# Altium schematic sheet Sheet1.SchDoc
size A4
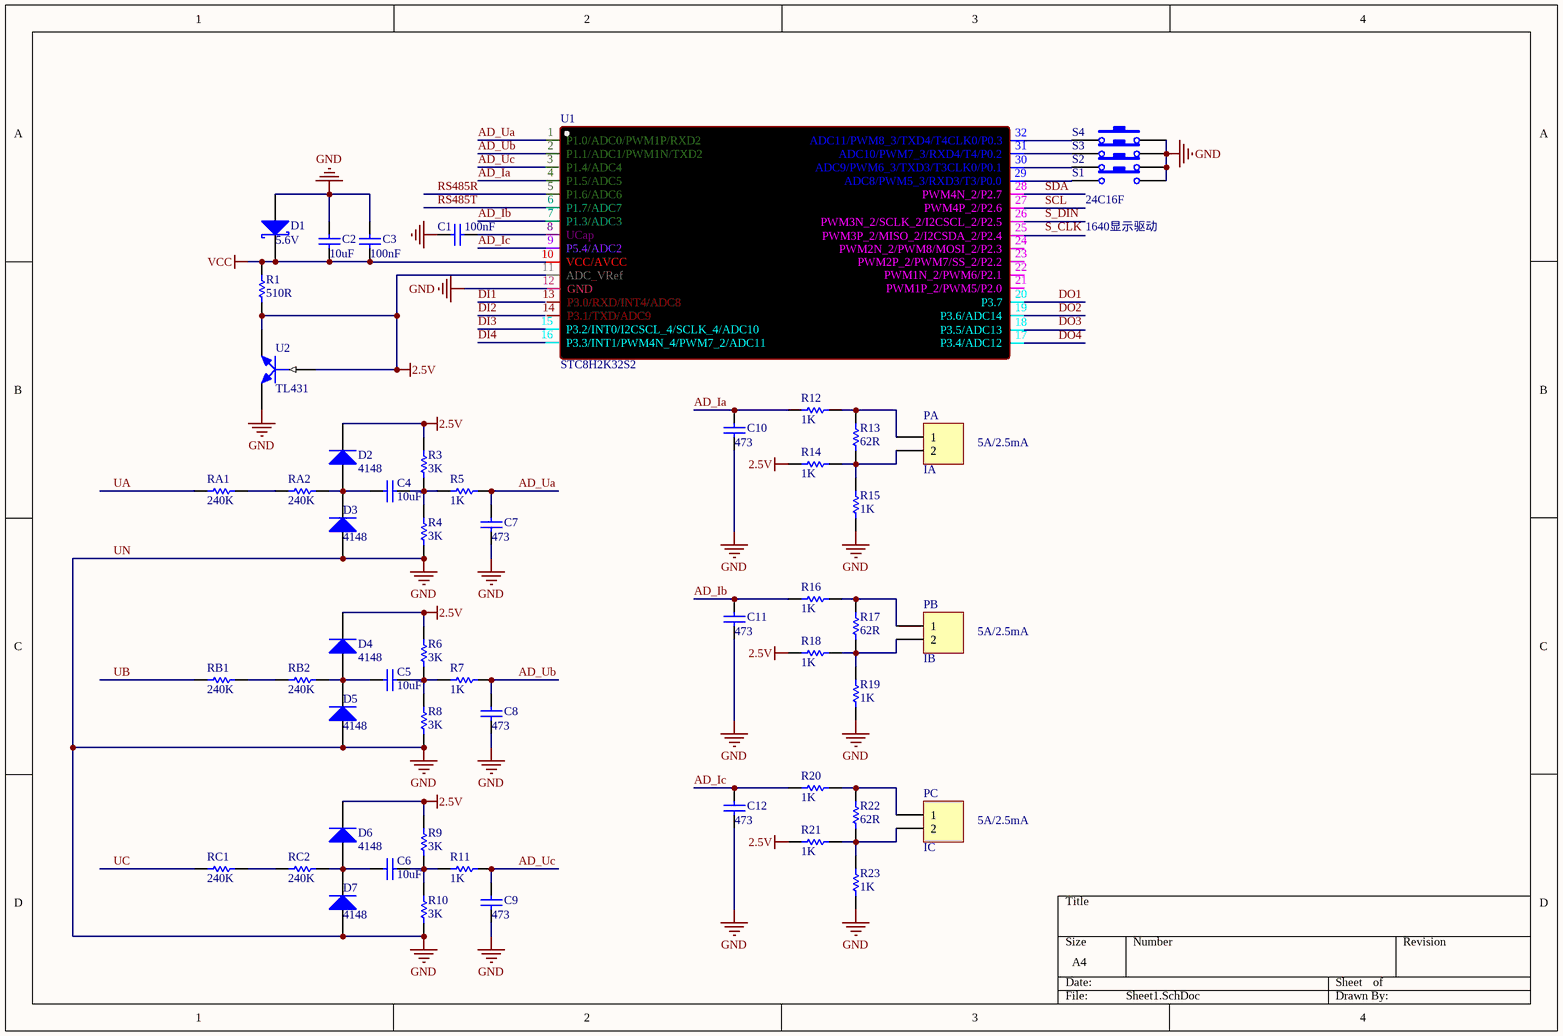
[diagram p0: Sheet1.SchDoc]

## Parts
C1  value 100nF  [RAD-0.3]  (hidden comment: Cap)
C2  value 10uF  [RAD-0.3]  (hidden comment: Cap)
C3  value 100nF  [RAD-0.3]  (hidden comment: Cap)
C4  value 10uF  [RAD-0.3]  (hidden comment: Cap)
C5  value 10uF  [RAD-0.3]  (hidden comment: Cap)
C6  value 10uF  [RAD-0.3]  (hidden comment: Cap)
C7  value 473  [RAD-0.3]  (hidden comment: Cap)
C8  value 473  [RAD-0.3]  (hidden comment: Cap)
C9  value 473  [RAD-0.3]  (hidden comment: Cap)
C10  value 473  [RAD-0.3]  (hidden comment: Cap)
C11  value 473  [RAD-0.3]  (hidden comment: Cap)
C12  value 473  [RAD-0.3]  (hidden comment: Cap)
D1  5.6V  [TO-220AC]
D2  4148  [SOT-23_N]
D3  4148  [SOT-23_N]
D4  4148  [SOT-23_N]
D5  4148  [SOT-23_N]
D6  4148  [SOT-23_N]
D7  4148  [SOT-23_N]
PA  IA  [HDR1X2]
PB  IB  [HDR1X2]
PC  IC  [HDR1X2]
R1  value 510R  [AXIAL-0.3]  (hidden comment: Res1)
R3  value 3K  [AXIAL-0.3]  (hidden comment: Res1)
R4  value 3K  [AXIAL-0.3]  (hidden comment: Res1)
R5  value 1K  [AXIAL-0.3]  (hidden comment: Res1)
R6  value 3K  [AXIAL-0.3]  (hidden comment: Res1)
R7  value 1K  [AXIAL-0.3]  (hidden comment: Res1)
R8  value 3K  [AXIAL-0.3]  (hidden comment: Res1)
R9  value 3K  [AXIAL-0.3]  (hidden comment: Res1)
R10  value 3K  [AXIAL-0.3]  (hidden comment: Res1)
R11  value 1K  [AXIAL-0.3]  (hidden comment: Res1)
R12  value 1K  [AXIAL-0.3]  (hidden comment: Res1)
R13  value 62R  [AXIAL-0.3]  (hidden comment: Res1)
R14  value 1K  [AXIAL-0.3]  (hidden comment: Res1)
R15  value 1K  [AXIAL-0.3]  (hidden comment: Res1)
R16  value 1K  [AXIAL-0.3]  (hidden comment: Res1)
R17  value 62R  [AXIAL-0.3]  (hidden comment: Res1)
R18  value 1K  [AXIAL-0.3]  (hidden comment: Res1)
R19  value 1K  [AXIAL-0.3]  (hidden comment: Res1)
R20  value 1K  [AXIAL-0.3]  (hidden comment: Res1)
R21  value 1K  [AXIAL-0.3]  (hidden comment: Res1)
R22  value 62R  [AXIAL-0.3]  (hidden comment: Res1)
R23  value 1K  [AXIAL-0.3]  (hidden comment: Res1)
RA1  value 240K  [AXIAL-0.3]  (hidden comment: Res1)
RA2  value 240K  [AXIAL-0.3]  (hidden comment: Res1)
RB1  value 240K  [AXIAL-0.3]  (hidden comment: Res1)
RB2  value 240K  [AXIAL-0.3]  (hidden comment: Res1)
RC1  value 240K  [AXIAL-0.3]  (hidden comment: Res1)
RC2  value 240K  [AXIAL-0.3]  (hidden comment: Res1)
S1  SW-PB  [SPST-2]  (value not drawn)
S2  SW-PB  [SPST-2]  (value not drawn)
S3  SW-PB  [SPST-2]  (value not drawn)
S4  SW-PB  [SPST-2]  (value not drawn)
U1  STC8H2K32S2  [LQFP32]
U2  TL431  [TO-262-AA]

## Nets
2.5V: D2.3(K) D4.3(K) D6.3(K) R1.2 R3.2 R6.2 R9.2 R14.2 R18.2 R21.2 U1.11(ADC_VRef) U2.1(B) U2.2(C)
UN: C1.1 C2.2 C3.2 C7.2 C8.2 C9.2 C10.2 C11.2 C12.2 D1.3(A) D3.1(A) D5.1(A) D7.1(A) R4.1 R8.1 R10.1 R15.2 R19.2 R23.2 S1.2 S2.2 S3.2 S4.2 U1.12(GND) U2.3(E)  [also labelled GND]
VCC: C2.1 C3.1 D1.1(K) R1.1 U1.10(VCC/AVCC)
AD_Ia: C10.1 R12.2 U1.4(P1.5/ADC5)
AD_Ib: C11.1 R16.2 U1.7(P1.3/ADC3)
AD_Ic: C12.1 R20.2 U1.9(P5.4/ADC2)
AD_Ua: C7.1 R5.1 U1.1(P1.0/ADC0/PWM1P/RXD2)
AD_Ub: C8.1 R7.1 U1.2(P1.1/ADC1/PWM1N/TXD2)
AD_Uc: C9.1 R11.1 U1.3(P1.4/ADC4)
DI3: U1.15(P3.2/INT0/I2CSCL_4/SCLK_4/ADC10)
DI4: U1.16(P3.3/INT1/PWM4N_4/PWM7_2/ADC11)
DO1: U1.20(P3.7)
DO2: U1.19(P3.6/ADC14)
DO4: U1.17(P3.4/ADC12)
RS485R: U1.5(P1.6/ADC6)
RS485T: U1.6(P1.7/ADC7)
S_DIN: U1.26(PWM3N_2/SCLK_2/I2CSCL_2/P2.5)
SCL: U1.27(PWM4P_2/P2.6)
SDA: U1.28(PWM4N_2/P2.7)
UA: RA1.1
UB: RB1.1
UC: RC1.1
NetC1_2: C1.2 U1.8(UCap)
NetC4_1: C4.1 R3.1 R4.2 R5.2
NetC4_2: C4.2 D2.1(A) D3.3(K) RA2.2
NetC5_1: C5.1 R6.1 R7.2 R8.2
NetC5_2: C5.2 D4.1(A) D5.3(K) RB2.2
NetC6_1: C6.1 R9.1 R10.2 R11.2
NetC6_2: C6.2 D6.1(A) D7.3(K) RC2.2
NetPA_1: PA.1 R12.1 R13.2
NetPA_2: PA.2 R13.1 R14.1 R15.1
NetPB_1: PB.1 R16.1 R17.2
NetPB_2: PB.2 R17.1 R18.1 R19.1
NetPC_1: PC.1 R20.1 R22.2
NetPC_2: PC.2 R21.1 R22.1 R23.1
NetRA1_2: RA1.2 RA2.1
NetRB1_2: RB1.2 RB2.1
NetRC1_2: RC1.2 RC2.1
NetS1_1: S1.1 U1.29(ADC8/PWM5_3/RXD3/T3/P0.0)
NetS2_1: S2.1 U1.30(ADC9/PWM6_3/TXD3/T3CLK0/P0.1)
NetS3_1: S3.1 U1.31(ADC10/PWM7_3/RXD4/T4/P0.2)
NetS4_1: S4.1 U1.32(ADC11/PWM8_3/TXD4/T4CLK0/P0.3)

Not connected (* = marked no-connect by the designer): U1 13(P3.0/RXD/INT4/ADC8) 14(P3.1/TXD/ADC9) 18(P3.5/ADC13) 21(PWM1P_2/PWM5/P2.0) 22(PWM1N_2/PWM6/P2.1) 23(PWM2P_2/PWM7/SS_2/P2.2) 24(PWM2N_2/PWM8/MOSI_2/P2.3) 25(PWM3P_2/MISO_2/I2CSDA_2/P2.4)

## Notes on the sheet
- (near S1) 24C16F
- 1640显示驱动
- 5A/2.5mA
- Labels drawn without touching a wire or pin: DO3, S_CLK

## Library data of the parts
C1-C12 = Cap: Capacitor; Published: 8-Jun-2000; LatestRevisionDate: 17-Jul-2002; LatestRevisionNote: Re-released for DXP Platform.; PackageReference: RAD-0.3; Publisher: Altium Limited; PackageDescription: Radial Cap, Thru-Hole; 2 Leads; 0.3 in Pin Spacing
D1 = Diode 10TQ045: Schottky Rectifier; Note: Terminal 2 is the TAB and is electrically connected to the cathode; Published: 8-Jun-2000; LatestRevisionDate: 17-Jul-2002; LatestRevisionNote: Re-released for DXP Platform.; DatasheetVersion: PD-2.057B; PackageVersion: Feb-1998; PackageReference: TO-220AC; Publisher: Altium Limited; PackageDescription: TO, Thru-Hole, Vertical, Heatsink Mounted; 3 In-Line Leads (1 Absent); Pitch 2.54 mm; ComponentLink1Description: Manufacturer Link; ComponentLink1URL: http://www.irf.com/; ComponentLink2Description: Datasheet; ComponentLink2URL: http://www.irf.com/product-info/datasheets/data/10tq.pdf
D2-D7 = Diode BAS21: Silicon Switching Diode for High-Speed, High-Voltage Switching; Note: Pin 2 is not connected and not drawn.; Published: 21-Mar-2003; LatestRevisionDate: 29-May-2009; LatestRevisionNote: IPC-7351 Footprint Added.; DatasheetVersion: Oct-1999; PackageVersion: Sep-2001; PackageReference: SOT-23; Publisher: Altium Limited; PackageDescription: 3-Pin SOT-23 Package 0.95 mm Pitch, 2.5 mm Lead Span; ComponentLink1Description: Manufacturer Link; ComponentLink1URL: http://www.infineon.com/; ComponentLink2Description: Datasheet; ComponentLink2URL: http://www.infineon.com/upload/Document/cmc_upload/documents/080/812/bas21series.pdf
PA PB PC = Header 2: Header, 2-Pin; LatestRevisionDate: 17-Jul-2002; LatestRevisionNote: Re-released for DXP Platform.; Publisher: Altium Limited
R1 R3-R23 RA1 RA2 RB1 RB2 RC1 RC2 = Res1: Resistor; Published: 8-Jun-2000; LatestRevisionDate: 17-Jul-2002; LatestRevisionNote: Re-released for DXP Platform.; PackageReference: AXIAL-0.3; Publisher: Altium Limited; PackageDescription: Axial Device, Thru-Hole; 2 Leads; 0.3 in Pin Spacing
S1-S4 = SW-PB: Switch; Published: 24-Mar-1999; LatestRevisionDate: 17-Jul-2002; LatestRevisionNote: Re-released for DXP Platform.; PackageReference: SPST-2; Publisher: Altium Limited; PackageDescription: Switch; 2 Leads
U1 = STC8H3K64S4: LQFP32
U2 = Diac-NPN: DIAC; Published: 24-Mar-1999; LatestRevisionDate: 17-Jul-2002; LatestRevisionNote: Re-released for DXP Platform.; PackageReference: TO-262-AA; Publisher: Altium Limited; Code_JEDEC: TO-262-AA